# Altium schematic sheet 19.SchDoc
size 513 x 386 mm
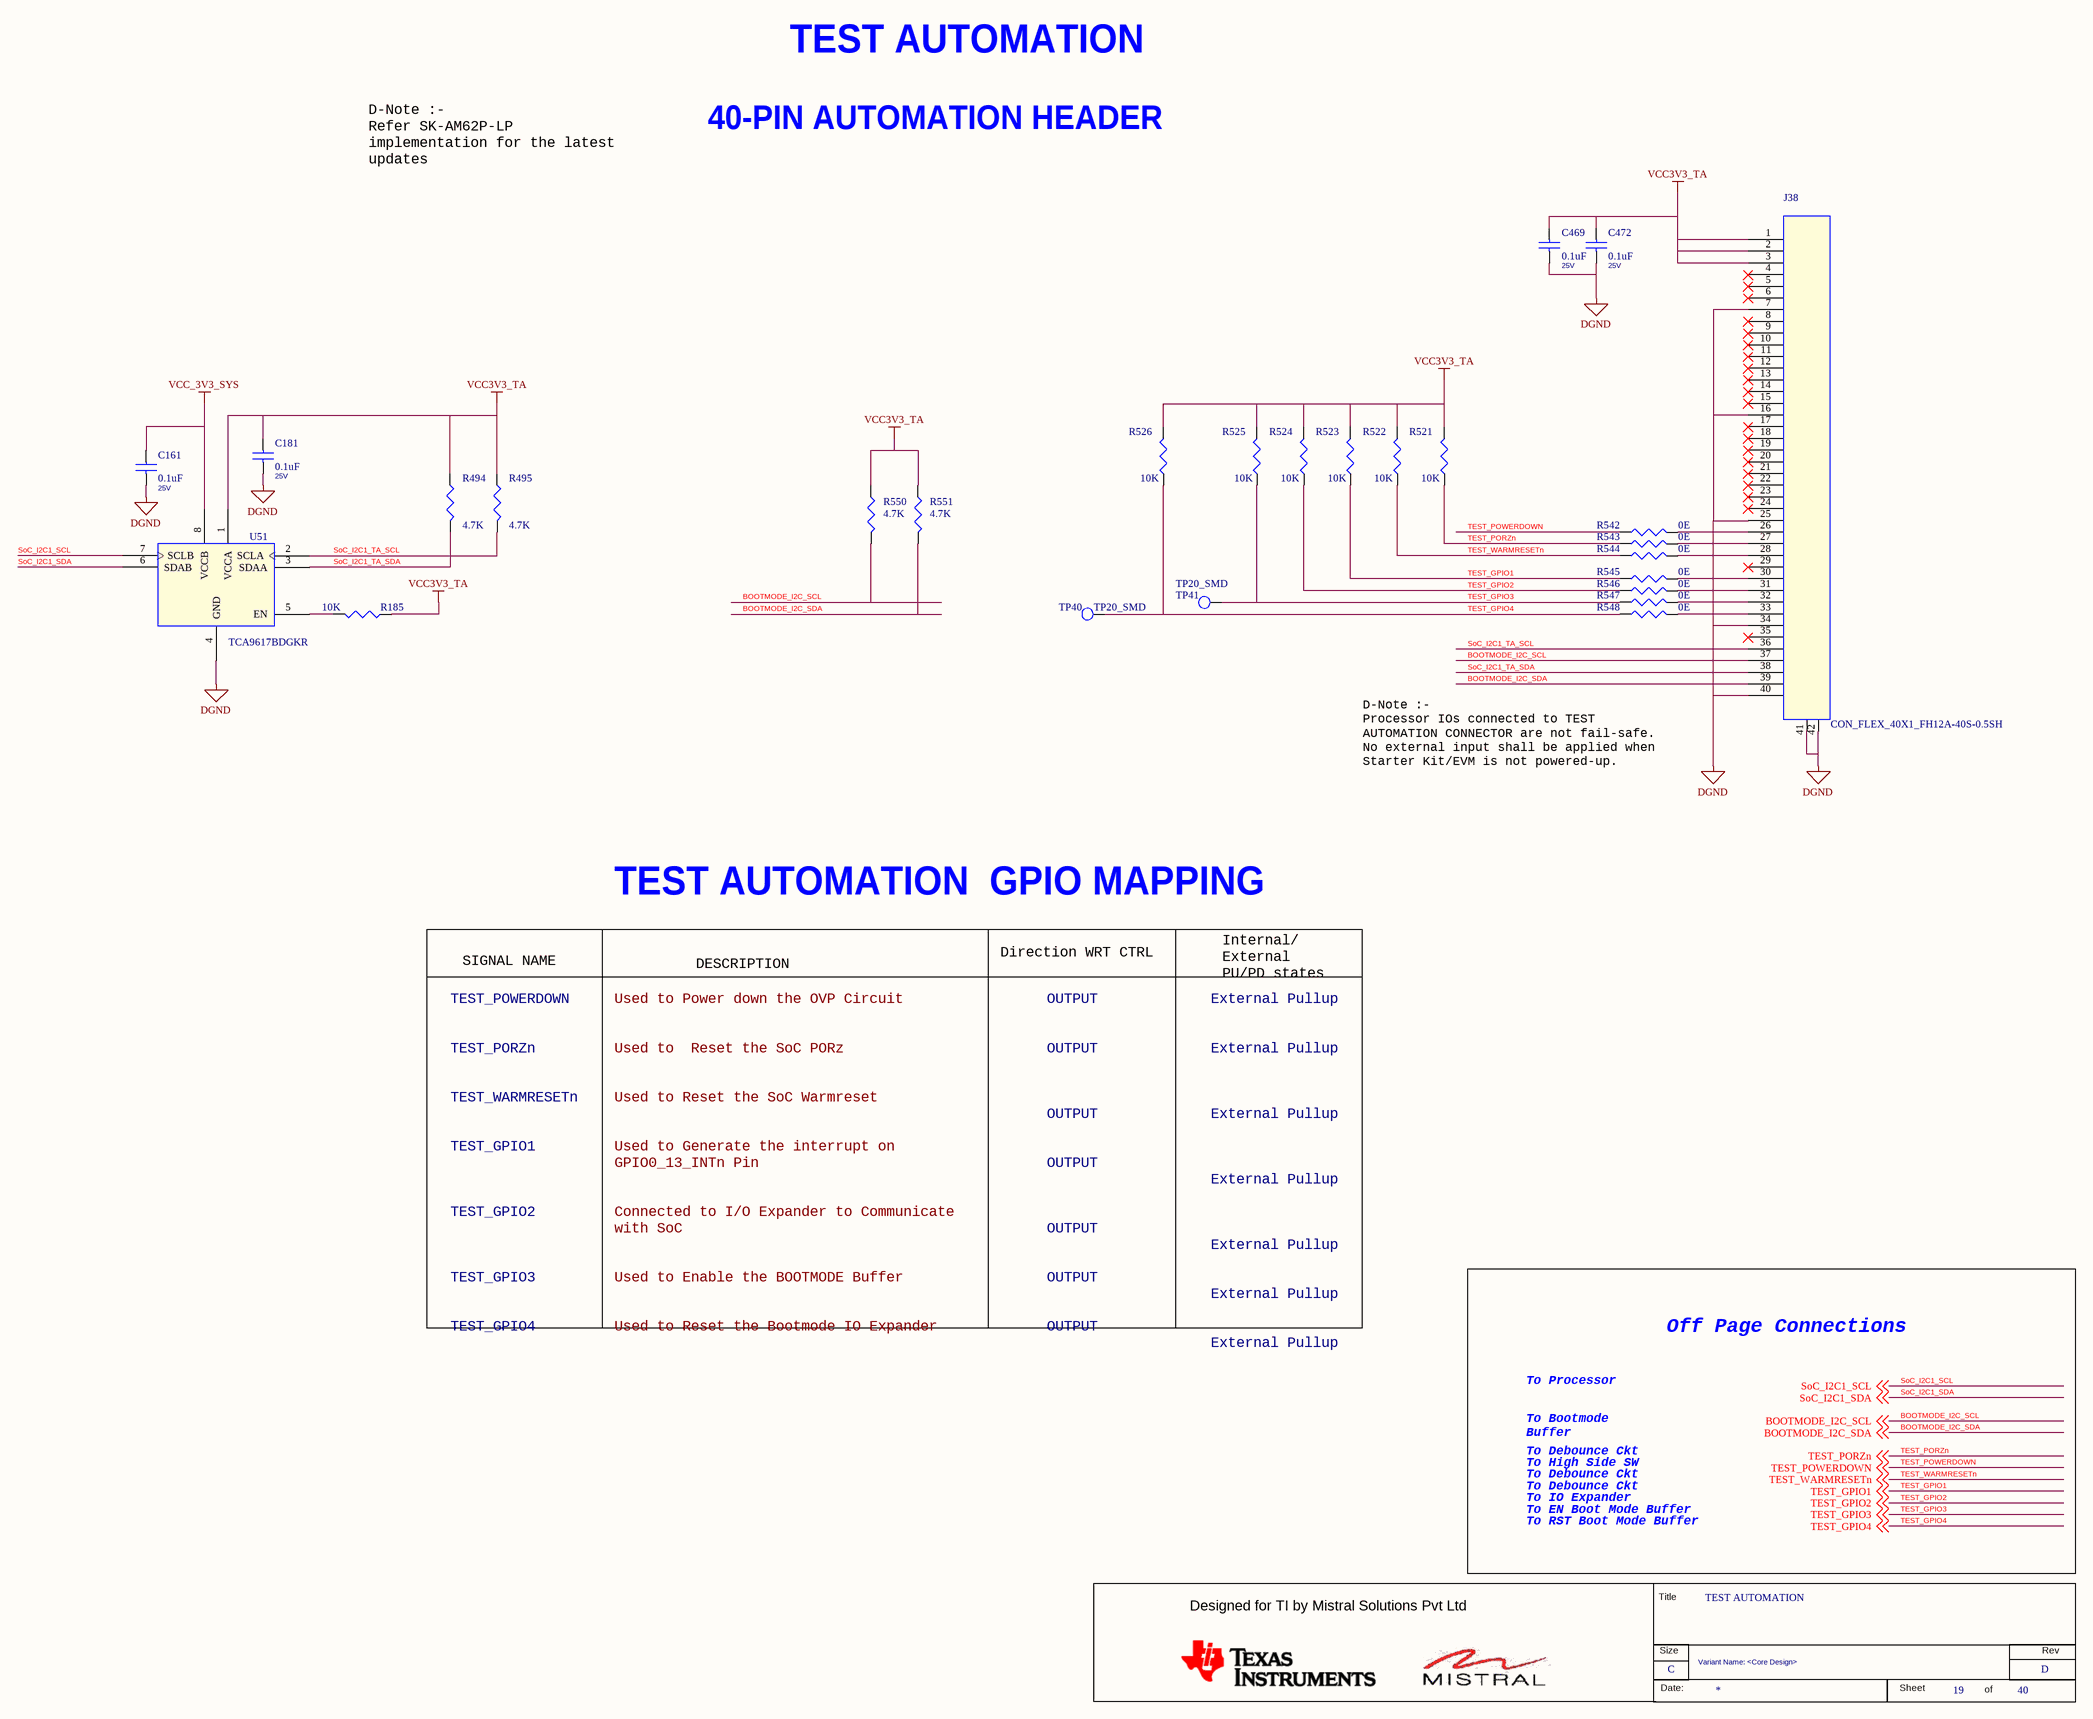
[diagram p0: 19.SchDoc]

## Parts
*  RevCode: D  Title: TEST AUTOMATION  Page Size: C  Page Number: 19  Page Count: 40  Variant Name: <Core Design>  (hidden comment: MISTRAL_TITLEBLK_CSIZE)  (graphical)
C161  0.1uF  Voltage: 25V  [CAP0402_0-75]
C181  0.1uF  Voltage: 25V  [CAP0402_0-75]
C469  0.1uF  Voltage: 25V  [CAP0402_0-75]
C472  0.1uF  Voltage: 25V  [CAP0402_0-75]
J38  CON_FLEX_40X1_FH12A-40S-0.5SH  [CON_FLEX40X1_FH12A_S_R_S]
R185  10K  [RES0402_0-5]
R494  4.7K  [RES0402_0-5]
R495  4.7K  [RES0402_0-5]
R521  10K  [RES0402_0-5]
R522  10K  [RES0402_0-5]
R523  10K  [RES0402_0-5]
R524  10K  [RES0402_0-5]
R525  10K  [RES0402_0-5]
R526  10K  [RES0402_0-5]
R542  0E  [RES0402_0-5]
R543  0E  [RES0402_0-5]
R544  0E  [RES0402_0-5]
R545  0E  [RES0402_0-5]
R546  0E  [RES0402_0-5]
R547  0E  [RES0402_0-5]
R548  0E  [RES0402_0-5]
R550  4.7K  [RES0402_0-5]
R551  4.7K  [RES0402_0-5]
TP40  TP20_SMD  [TP20_SMD]
TP41  TP20_SMD  [TP20_SMD]
U51  TCA9617BDGKR  [VSSOP8_25-59_120X120_1-1]

## Nets
DGND: C161.2 C181.2 C469.2 C472.2 J38.7 J38.16 J38.25 J38.34 J38.40 J38.41 J38.42 U51.4(GND)
VCC3V3_TA: C181.1 C469.1 C472.1 J38.1 J38.2 J38.3 R185.2 R494.1 R495.1 R521.2 R522.2 R523.2 R524.2 R525.2 R526.2 R550.1 R551.1 U51.1(VCCA)
VCC_3V3_SYS: C161.1 U51.8(VCCB)
BOOTMODE_I2C_SCL: J38.37 R550.2 ; off-sheet BOOTMODE_I2C_SCL
BOOTMODE_I2C_SDA: J38.39 R551.2 ; off-sheet BOOTMODE_I2C_SDA
SoC_I2C1_SCL: U51.7(SCLB) ; off-sheet SoC_I2C1_SCL
SoC_I2C1_SDA: U51.6(SDAB) ; off-sheet SoC_I2C1_SDA
SoC_I2C1_TA_SCL: J38.36 R495.2 U51.2(SCLA)
SoC_I2C1_TA_SDA: J38.38 R494.2 U51.3(SDAA)
TEST_GPIO1: R523.1 R545.1 ; off-sheet TEST_GPIO1
TEST_GPIO2: R524.1 R546.1 ; off-sheet TEST_GPIO2
TEST_GPIO3: R525.1 R547.1 TP41.1(TP) ; off-sheet TEST_GPIO3
TEST_GPIO4: R526.1 R548.1 TP40.1(TP) ; off-sheet TEST_GPIO4
TEST_PORZn: R521.1 R543.1 ; off-sheet TEST_PORZn
TEST_POWERDOWN: R542.1 ; off-sheet TEST_POWERDOWN
TEST_WARMRESETn: R522.1 R544.1 ; off-sheet TEST_WARMRESETn
NetJ38_26: J38.26 R542.2
NetJ38_27: J38.27 R543.2
NetJ38_28: J38.28 R544.2
NetJ38_30: J38.30 R545.2
NetJ38_31: J38.31 R546.2
NetJ38_32: J38.32 R547.2
NetJ38_33: J38.33 R548.2
NetR185_1: R185.1 U51.5(EN)

Not connected (* = marked no-connect by the designer): J38 4* 5* 6* 8* 9* 10* 11* 12* 13* 14* 15* 17* 18* 19* 20* 21* 22* 23* 24* 29* 35*

## Notes on the sheet
- D-Note :-
  Refer SK-AM62P-LP
  implementation for the latest
  updates
- TEST AUTOMATION
- 40-PIN AUTOMATION HEADER
- D-Note :-
  Processor IOs connected to TEST
  AUTOMATION CONNECTOR are not fail-safe.
  No external input shall be applied when
  Starter Kit/EVM is not powered-up.
- TEST AUTOMATION  GPIO MAPPING
- SIGNAL NAME
- DESCRIPTION
- Direction WRT CTRL
- Internal/
  External
  PU/PD states
- TEST_POWERDOWN
  TEST_PORZn
  TEST_WARMRESETn
  TEST_GPIO1
  TEST_GPIO2
  TEST_GPIO3
  TEST_GPIO4
- Used to Power down the OVP Circuit
  Used to  Reset the SoC PORz
  Used to Reset the SoC Warmreset
  Used to Generate the interrupt on
  GPIO0_13_INTn Pin
  Connected to I/O Expander to Communicate
  with SoC
  Used to Enable the BOOTMODE Buffer
  Used to Reset the Bootmode IO Expander
- OUTPUT
  OUTPUT
  OUTPUT
  OUTPUT
  OUTPUT
  OUTPUT
  OUTPUT
- External Pullup
  External Pullup
  External Pullup
  External Pullup
  External Pullup
  External Pullup
  External Pullup
- To Processor
- Off Page Connections
- To Bootmode
  Buffer
- To Debounce Ckt
- To IO Expander
- To High Side SW
- To RST Boot Mode Buffer
- To EN Boot Mode Buffer
- (in symbol MISTRAL_TITLEBLK_CSIZE) Title; Designed for TI by Mistral Solutions Pvt Ltd; Size; Rev; Date:; Sheet; of

## Library data of the parts
* = MISTRAL_TITLEBLK_CSIZE: Issue: 1.0; Page Create Date: March  8, 1995; Page Modify Date: *
C161 C469 C472 = CAP_Dup3: CAP CERAMIC 0.1uF 25V 20% X5R 0402; Alt_Mfr_part_number: CC0402KRX5R8BB104; Mistral Part No: 120020080003-R; Mfr_name: WURTH ELECTRONICS; Mfr_part_number: 885012105018; Part_type: CAPACITORS\CERAMIC; Alt_Mfr_name: YAGEO AMERICA; Project: AM64x_EVM_BRD; Wattage: NA; Customs_HS_Code: 85322990; Custom_Duty: 15%; PCB Footprint: CAP0402_0-75; Tolerance: 20%; Package: 0402; Distributor_name: DIGIKEY; Distributor_part_number: 732-7495-1-ND; Height: 0.55MM; Weight: 0.65mg; Temperature: -55癈+85癈; Datasheet: Y:\MIS_DATABASE\DATASHEETS\CAPACITORS\885012105018.PDF; Crtd /date: ALVY/170820; Chkd/date: MANIRAJA/170820; MECHANICAL 3D STEP FILE: CAP0402_0-75; Library Ref: CAP; Footprint Ref: CAP0402_0-75; Library Path: Y:\MIS_DATABASE\Library\ALTIUM_TOOL\SCHEMATICS_PARTS\MS_DISCRETE_Library.schlib; Footprint Path: Y:\MIS_DATABASE\Library\ALTIUM_TOOL\PCB_FOOTPRINTS\Altium_Footprint_Lib.PcbLib
C181 = CAP_Dup3: CAP CERAMIC 0.1uF 25V 20% X5R 0402; Alt_Mfr_name: YAGEO AMERICA; Part_type: CAPACITORS\CERAMIC; Mfr_part_number: 885012105018; Mfr_name: WURTH ELECTRONICS; Mistral Part No: 120020080003-R; Alt_Mfr_part_number: CC0402KRX5R8BB104; Custom_Duty: 15%; Customs_HS_Code: 85322990; Wattage: NA; Project: AM64x_EVM_BRD; PCB Footprint: CAP0402_0-75; Footprint Path: Y:\MIS_DATABASE\Library\ALTIUM_TOOL\PCB_FOOTPRINTS\Altium_Footprint_Lib.PcbLib; Library Path: Y:\MIS_DATABASE\Library\ALTIUM_TOOL\SCHEMATICS_PARTS\MS_DISCRETE_Library.schlib; Footprint Ref: CAP0402_0-75; Library Ref: CAP; MECHANICAL 3D STEP FILE: CAP0402_0-75; Chkd/date: MANIRAJA/170820; Crtd /date: ALVY/170820; Datasheet: Y:\MIS_DATABASE\DATASHEETS\CAPACITORS\885012105018.PDF; Temperature: -55癈+85癈; Weight: 0.65mg; Height: 0.55MM; Distributor_part_number: 732-7495-1-ND; Distributor_name: DIGIKEY; Package: 0402; Tolerance: 20%
J38 = CON_FLEX_40X1_FH12A-40S-0.5SH: CON FPC 40X1 0.50MM PITCH RT TOP SMD; Mistral Part No: 150009030176-R; Mfr_name: HIROSE ELECTRIC EUROPE; Mfr_part_number: FH12A-40S-0.5SH(55); Part_type: CONNECTOR\FPC; Project: PMP LCD BOARD; Customs_HS_Code: 85369090; Custom_Duty: 24%; PCB Footprint: CON_FLEX40X1_FH12A_S_R_S; Package: SMD; Distributor_name: DIGIKEY; Distributor_part_number: HFK40CT-ND; Height: 2.00MM; Datasheet: Y:\MIS_DATABASE\DATASHEETS\CONNECTORS\FH12SERIES.PDF; Crtd /date: MAZHAR/171106; Chkd/date: SHREESHAIL/201106; Library Ref: CON_FLEX_40X1_FH12A-40S-0.5SH
R185 R526 = RESISTOR_Dup6: RES 10K 1/16W 5% 0402; Part_type: RESISTORS\FIXED; Mfr_part_number: RC0402JR-0710KL; Mfr_name: YAGEO AMERICA; Mistral Part No: 110011060021-R; Custom_Duty: 15%; Customs_HS_Code: 85332119; Voltage: NA; Project: HSE; MECHANICAL 3D STEP FILE: RES0402_0-5; Chkd/date: VASANTHA/061216; Crtd /date: MAZHAR/230805; Datasheet: Y:\MIS_DATABASE\DATASHEETS\RESISTORS\RCXXXXL-SER_MAR18.PDF; Temperature: -55癈+155癈; Weight: 0.65mg; Height: 0.40MM; Distributor_part_number: 311-10KJRCT-ND; Distributor_name: DIGIKEY; Package: 0402; Wattage: 1/16W; Tolerance: 5%; Library Ref: RESISTOR; Footprint Ref: RES0402_0-5; Library Path: Y:\MIS_DATABASE\Library\ALTIUM_TOOL\SCHEMATICS_PARTS\MS_DISCRETE_Library.schlib; Footprint Path: Y:\MIS_DATABASE\Library\ALTIUM_TOOL\PCB_FOOTPRINTS\Altium_Footprint_Lib.PcbLib; PCB Footprint: RES0402_0-5
R494 R495 R550 R551 = RESISTOR_Dup6: RES 4.7K 1/16W 5% 0402; Mistral Part No: 110011060001-R; Mfr_name: YAGEO AMERICA; Mfr_part_number: RC0402JR-074K7L; Part_type: RESISTORS\FIXED; Project: TMDXCSK368; Voltage: NA; Customs_HS_Code: 85332119; Custom_Duty: 15%; Tolerance: 5%; Wattage: 1/16W; Package: 0402; Distributor_name: DIGIKEY; Distributor_part_number: 311-4.7KJRCT-ND; Height: 0.40MM; Weight: 0.65mg; Temperature: -55癈+155癈; Datasheet: Y:\MIS_DATABASE\DATASHEETS\RESISTORS\RCXXXXL-SER_MAR18.PDF; Crtd /date: VASANTHA/130516; Chkd/date: VASANTHA/130516; Library Ref: RESISTOR; Footprint Ref: RES0402_0-5; MECHANICAL 3D STEP FILE: RES0402_0-5; Library Path: Y:\MIS_DATABASE\Library\ALTIUM_TOOL\SCHEMATICS_PARTS\MS_DISCRETE_Library.schlib; Footprint Path: Y:\MIS_DATABASE\Library\ALTIUM_TOOL\PCB_FOOTPRINTS\Altium_Footprint_Lib.PcbLib; PCB Footprint: RES0402_0-5
R521-R525 = RESISTOR_Dup6: RES 10K 1/16W 5% 0402; Mistral Part No: 110011060021-R; Mfr_name: YAGEO AMERICA; Mfr_part_number: RC0402JR-0710KL; Part_type: RESISTORS\FIXED; Project: HSE; Voltage: NA; Customs_HS_Code: 85332119; Custom_Duty: 15%; Footprint Path: Y:\MIS_DATABASE\Library\ALTIUM_TOOL\PCB_FOOTPRINTS\Altium_Footprint_Lib.PcbLib; Library Path: Y:\MIS_DATABASE\Library\ALTIUM_TOOL\SCHEMATICS_PARTS\MS_DISCRETE_Library.schlib; Footprint Ref: RES0402_0-5; Library Ref: RESISTOR; Tolerance: 5%; Wattage: 1/16W; Package: 0402; Distributor_name: DIGIKEY; Distributor_part_number: 311-10KJRCT-ND; Height: 0.40MM; Weight: 0.65mg; Temperature: -55癈+155癈; Datasheet: Y:\MIS_DATABASE\DATASHEETS\RESISTORS\RCXXXXL-SER_MAR18.PDF; Crtd /date: MAZHAR/230805; Chkd/date: VASANTHA/061216; MECHANICAL 3D STEP FILE: RES0402_0-5; PCB Footprint: RES0402_0-5
R542 R544-R546 R548 = RESISTOR_Dup5: RES 0E 1/16W JUMPER 0402; Part_type: RESISTORS\FIXED; Mfr_part_number: CRCW04020000Z0ED; Mfr_name: VISHAY; Mistral Part No: 110010080019-R; Custom_Duty: 15%; Customs_HS_Code: 85332119; Voltage: NA; Project: PB_BUGBASE; PCB Footprint: RES0402_0-5; Footprint Path: Y:\MIS_DATABASE\Library\ALTIUM_TOOL\PCB_FOOTPRINTS\Altium_Footprint_Lib.PcbLib; Library Path: Y:\MIS_DATABASE\Library\ALTIUM_TOOL\SCHEMATICS_PARTS\MS_DISCRETE_Library.schlib; Footprint Ref: RES0402_0-5; Library Ref: RESISTOR; Chkd/date: VASANTHA/201216; Crtd /date: MUDDU/190810; Datasheet: Y:\MIS_DATABASE\DATASHEETS\RESISTORS\CRCW0603.PDF; Temperature: -55癈+155癈; Weight: 0.65mg; Height: 0.40MM; Distributor_part_number: 541-0.0JCT-ND; Distributor_name: DIGIKEY; Package: 0402; Wattage: 1/16W; Tolerance: NA; MECHANICAL 3D STEP FILE: RES0402_0-5
R543 R547 = RESISTOR_Dup5: RES 0E 1/16W JUMPER 0402; Mistral Part No: 110010080019-R; Mfr_name: VISHAY; Mfr_part_number: CRCW04020000Z0ED; Part_type: RESISTORS\FIXED; Project: PB_BUGBASE; Tolerance: NA; Customs_HS_Code: 85332119; Custom_Duty: 15%; PCB Footprint: RES0402_0-5; Footprint Path: Y:\MIS_DATABASE\Library\ALTIUM_TOOL\PCB_FOOTPRINTS\Altium_Footprint_Lib.PcbLib; Library Path: Y:\MIS_DATABASE\Library\ALTIUM_TOOL\SCHEMATICS_PARTS\MS_DISCRETE_Library.schlib; Footprint Ref: RES0402_0-5; Library Ref: RESISTOR; Voltage: NA; Wattage: 1/16W; Package: 0402; Distributor_name: DIGIKEY; Distributor_part_number: 541-0.0JCT-ND; Height: 0.40MM; Weight: 0.65mg; Temperature: -55癈+155癈; Datasheet: Y:\MIS_DATABASE\DATASHEETS\RESISTORS\CRCW0603.PDF; Crtd /date: MUDDU/190810; Chkd/date: VASANTHA/201216; MECHANICAL 3D STEP FILE: RES0402_0-5
TP40 TP41 = TESTPOINT: TESTPOINT CIR 20 SMD; Mfr_name: LOCAL; Custom_Duty: NA; Project: BT MODULE_CSRBC04; Customs_HS_Code: NA; PCB Footprint: TP20_SMD; RoHS: NA; Footprint Ref: TP20_SMD; Library Ref: TESTPOINT; Mistral Part No: NA; Mfr_part_number: TP20_SMD; Part_type: TESTPOINT; Package: SMD; Distributor_name: NA; Distributor_part_number: NA; Height: NA; Crtd /date: MAZHAR/171006; Chkd/date: SHREESHAIL/171006; Tolerance: NA; Voltage: NA; Wattage: NA; Weight: NA; Temperature: NA; Datasheet: NA; MECHANICAL 3D STEP FILE: NA; Library Path: Y:\MIS_DATABASE\Library\ALTIUM_TOOL\SCHEMATICS_PARTS\MS_DISCRETE_Library.schlib; Footprint Path: Y:\MIS_DATABASE\Library\ALTIUM_TOOL\PCB_FOOTPRINTS\Altium_Footprint_Lib.PcbLib
U51 = TCA9617BDGKR_VSSOP8: IC FM+I2C BUS REPEATER LEVEL TRANSLATOR VSSOP8; Mistral Part No: 141017100010-R; Mfr_name: TEXAS INSTRUMENTS; Part_type: ICS\INTERFACE\LEVEL TRANSLATOR; Project: TI_MAXIE_CPB; Tolerance: NA; Customs_HS_Code: 85423100; Custom_Duty: 15%; Mfr_part_number: TCA9617BDGKR; Voltage: NA; Wattage: NA; Package: VSSOP8; Distributor_name: DIGIKEY; Distributor_part_number: 296-40579-1-ND; Library Ref: TCA9617BDGKR_VSSOP8; Height: 1.10MM; Weight: NA; Temperature: -40癈+85癈; Datasheet: Y:\MIS_DATABASE\DATASHEETS\ICS\INTERFACE\TCA9617B.PDF; Crtd /date: MANIRAJA/131017; Chkd/date: MANIRAJA/131017; MECHANICAL 3D STEP FILE: VSSOP8_25-59_120X120_1-1; PCB Footprint: VSSOP8_25-59_120X120_1-1